# EAGLE design Power_Sense_Rev_2.2.1 (EAGLE 7.7.0)
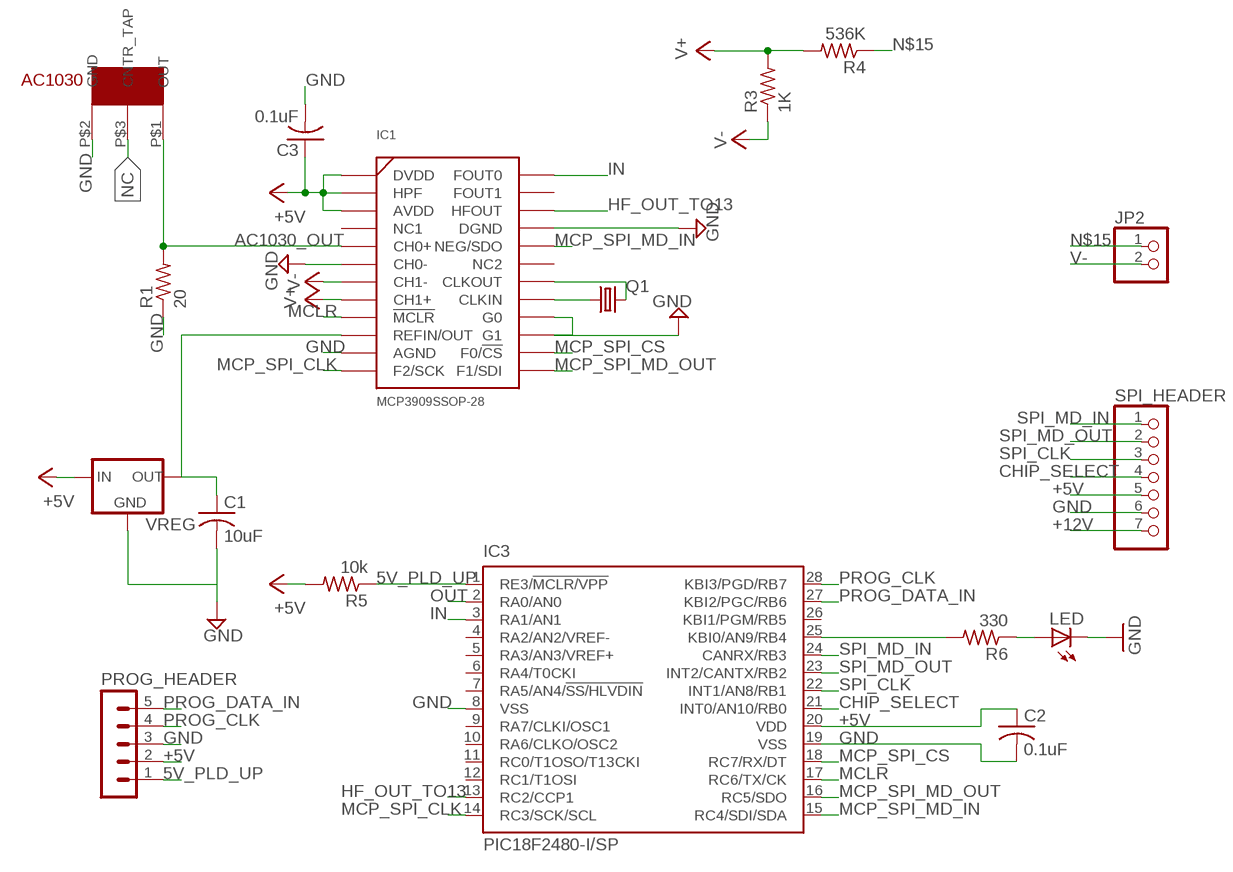
[diagram p0: schematic, sheet 1]

## Parts
AC1030  AC1030  [AC1030]
C1  10uF  C-US025-024X044  [C025-024X044]
C2  0.1uF  C-US025-024X044  [C025-024X044]
C3  0.1uF  C-US025-024X044  [C025-024X044]
IC1  MCP3909SSOP-28  [SSOP-24]
IC3  PIC18F2480-I/SP  [DIL28-3]
JP2  PINHD-1X2  [1X02]
LED  LED3MM  [LED3MM]
PROG_HEADER  MA05-1  [MA05-1]
Q1  CRYSTALHC49S  [HC49/S]
R1  20  R-US_0204/7  [0204/7]
R3  1K  R-US_0204/7  [0204/7]
R4  536K  R-US_0204/7  [0204/7]
R5  10k  R-US_0204/7  [0204/7]
R6  330  R-US_0204/7  [0204/7]
SPI_HEADER  PINHD-1X7  [1X07]
VREG  MCP1700INLINE  [TO92-INLINE]

## Nets
5V_PLD_UP: IC3.1(RE3/!MCLR/VPP) PROG_HEADER.1 R5.1
+5V: C2.1 C3.1 IC1.1(DVDD) IC1.2(HPF) IC1.3(AVDD) IC3.20(VDD) PROG_HEADER.2 R5.2 SPI_HEADER.5 VREG.2(IN)
+12V: SPI_HEADER.7
AC1030_OUT: AC1030.P$1(OUT) IC1.5(CH0+) R1.2
CHIP_SELECT: IC3.21(INT0/AN10/RB0) SPI_HEADER.4
GND: AC1030.P$2(GND) C1.2 C2.2 C3.2 IC1.6(CH0-) IC1.11(AGND) IC1.15(G1) IC1.16(G0) IC1.21(DGND) IC3.8(VSS) IC3.19(VSS) LED.K(C) PROG_HEADER.3 R1.1 SPI_HEADER.6 VREG.1(GND)
HF_OUT_TO13: IC1.22(HFOUT) IC3.13(RC2/CCP1)
IN: IC1.24(FOUT0) IC3.3(RA1/AN1)
MCLR: IC1.9(!MCLR!) IC3.17(RC6/TX/CK)
MCP_SPI_CLK: IC1.12(F2/SCK) IC3.14(RC3/SCK/SCL)
MCP_SPI_CS: IC1.14(F0/!CS!) IC3.18(RC7/RX/DT)
MCP_SPI_MD_IN: IC1.20(NEG/SDO) IC3.15(RC4/SDI/SDA)
MCP_SPI_MD_OUT: IC1.13(F1/SDI) IC3.16(RC5/SDO)
N$1: IC3.25(KBI0/AN9/RB4) R6.2
N$2: LED.A R6.1
N$5: IC1.17(CLKIN) Q1.1
N$6: IC1.18(CLKOUT) Q1.2
N$7: C1.1 IC1.10(REFIN/OUT) VREG.3(OUT)
N$15: JP2.1 R4.1
NC: AC1030.P$3(CNTR_TAP)
OUT: IC3.2(RA0/AN0)
PROG_CLK: IC3.28(KBI3/PGD/RB7) PROG_HEADER.4
PROG_DATA_IN: IC3.27(KBI2/PGC/RB6) PROG_HEADER.5
SPI_CLK: IC3.22(INT1/AN8/RB1) SPI_HEADER.3
SPI_MD_IN: IC3.24(CANRX/RB3) SPI_HEADER.1
SPI_MD_OUT: IC3.23(INT2/CANTX/RB2) SPI_HEADER.2
V+: IC1.8(CH1+) R3.2 R4.2
V-: IC1.7(CH1-) JP2.2 R3.1
Unconnected: IC1.4(NC1) IC1.19(NC2) IC1.23(FOUT1) IC3.4(RA2/AN2/VREF-) IC3.5(RA3/AN3/VREF+) IC3.6(RA4/T0CKI) IC3.7(RA5/AN4/!SS/HLVDIN) IC3.9(RA7/CLKI/OSC1) IC3.10(RA6/CLKO/OSC2) IC3.11(RC0/T1OSO/T13CKI) IC3.12(RC1/T1OSI) IC3.26(KBI1/PGM/RB5)

## Library data of the parts
AC1030 = .KWHR Library:AC1030
C1-C3 = adafruit:C-US: CAPACITOR, American symbol
IC1 = .KWHR Library:MCP3909: MCP3909 - We use this to sense current; HEIGHT: 1.65
IC3 = microchip:PIC18F2*80: 28-Pin Enhanced Flash Microcontrollers with ECAN(TM) Technology 10-Bit A/D and nanoWatt Technology Source: http://www.microchip.com .. 39637a.pdf; MF: MICROCHIP; MPN: PIC18F2480-I/SP; OC_FARNELL: 9321217; OC_NEWARK: 71J7237
JP2 = pinhead:PINHD-1X2: PIN HEADER
LED = led:LED: LED OSRAM: - CHIPLED LG R971, LG N971, LY N971, LG Q971, LY Q971, LO R971, LY R971 LH N974, LH R974 LS Q976, LO Q976, LY Q976 LO Q996 - Hyper CHIPLED LW Q18S LB Q993, LB Q99A, LB R99A - SideLED LS A670, LO A670, LY A670, LG A670, LP A670 LB A673, LV A673, LT A673, LW A673 LH A674 LY A675 LS A676, LA A676, LO A676, LY A676, LW A676 LS A679, LY A679, LG A679 - Hyper Micro SIDELED® LS Y876, LA Y876, LO Y876, LY Y876 LT Y87S - SmartLED LW L88C, LW L88S LB L89C, LB L89S, LG L890 LS L89K, LO L89K, LY L89K LS L896, LA L896, LO L896, LY L896 - TOPLED LS T670, LO T670, LY T670, LG T670, LP T670 LSG T670, LSP T670, LSY T670, LOP T670, LYG T670 LG T671, LOG T671, LSG T671 LB T673, LV T673, LT T673, LW T673 LH T674 LS T676, LA T676, LO T676, LY T676, LB T676, LH T676, LSB T676, LW T676 LB T67C, LV T67C, LT T67C, LS T67K, LO T67K, LY T67K, LW E67C LS E67B, LA E67B, LO E67B, LY E67B, LB E67C, LV E67C, LT E67C LW T67C LS T679, LY T679, LG T679 LS T770, LO T770, LY T770, LG T770, LP T770 LB T773, LV T773, LT T773, LW T773 LH T774 LS E675, LA E675, LY E675, LS T675 LS T776, LA T776, LO T776, LY T776, LB T776 LHGB T686 LT T68C, LB T68C - Hyper Mini TOPLED® LB M676 - Mini TOPLED Santana® LG M470 LS M47K, LO M47K, LY M47K Source: http://www.osram.convergy.de LUXEON: - LUMILED® LXK2-PW12-R00, LXK2-PW12-S00, LXK2-PW14-U00, LXK2-PW14-V00 LXK2-PM12-R00, LXK2-PM12-S00, LXK2-PM14-U00 LXK2-PE12-Q00, LXK2-PE12-R00, LXK2-PE12-S00, LXK2-PE14-T00, LXK2-PE14-U00 LXK2-PB12-K00, LXK2-PB12-L00, LXK2-PB12-M00, LXK2-PB14-N00, LXK2-PB14-P00, LXK2-PB14-Q00 LXK2-PR12-L00, LXK2-PR12-M00, LXK2-PR14-Q00, LXK2-PR14-R00 LXK2-PD12-Q00, LXK2-PD12-R00, LXK2-PD12-S00 LXK2-PH12-R00, LXK2-PH12-S00 LXK2-PL12-P00, LXK2-PL12-Q00, LXK2-PL12-R00 Source: www.luxeon.com KINGBRIGHT: KA-3528ASYC Source: www.kingbright.com
PROG_HEADER = con-lstb:MA05-1: PIN HEADER; OC_FARNELL: unknown; OC_NEWARK: unknown
Q1 = adafruit:CRYSTAL: CRYSTAL; OC_FARNELL: 1667008; OC_NEWARK: unknown
R1 R3-R6 = adafruit:R-US_: RESISTOR, American symbol
SPI_HEADER = pinhead:PINHD-1X7: PIN HEADER
VREG = adafruit:MCP1700: VOLTAGE REGULATOR

## Net classes
0 default: width 0.762 mm

## Board
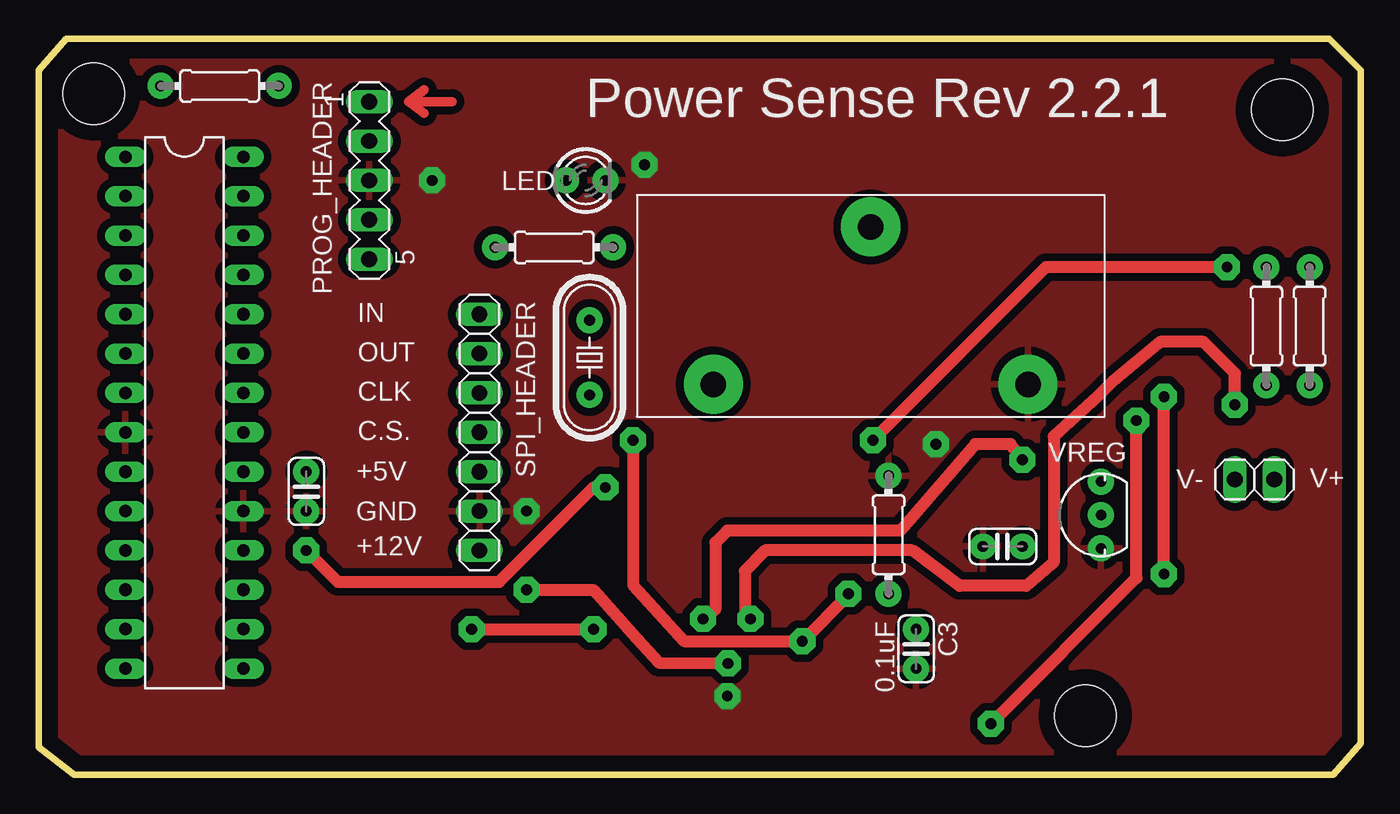
[diagram p1: board, top side]
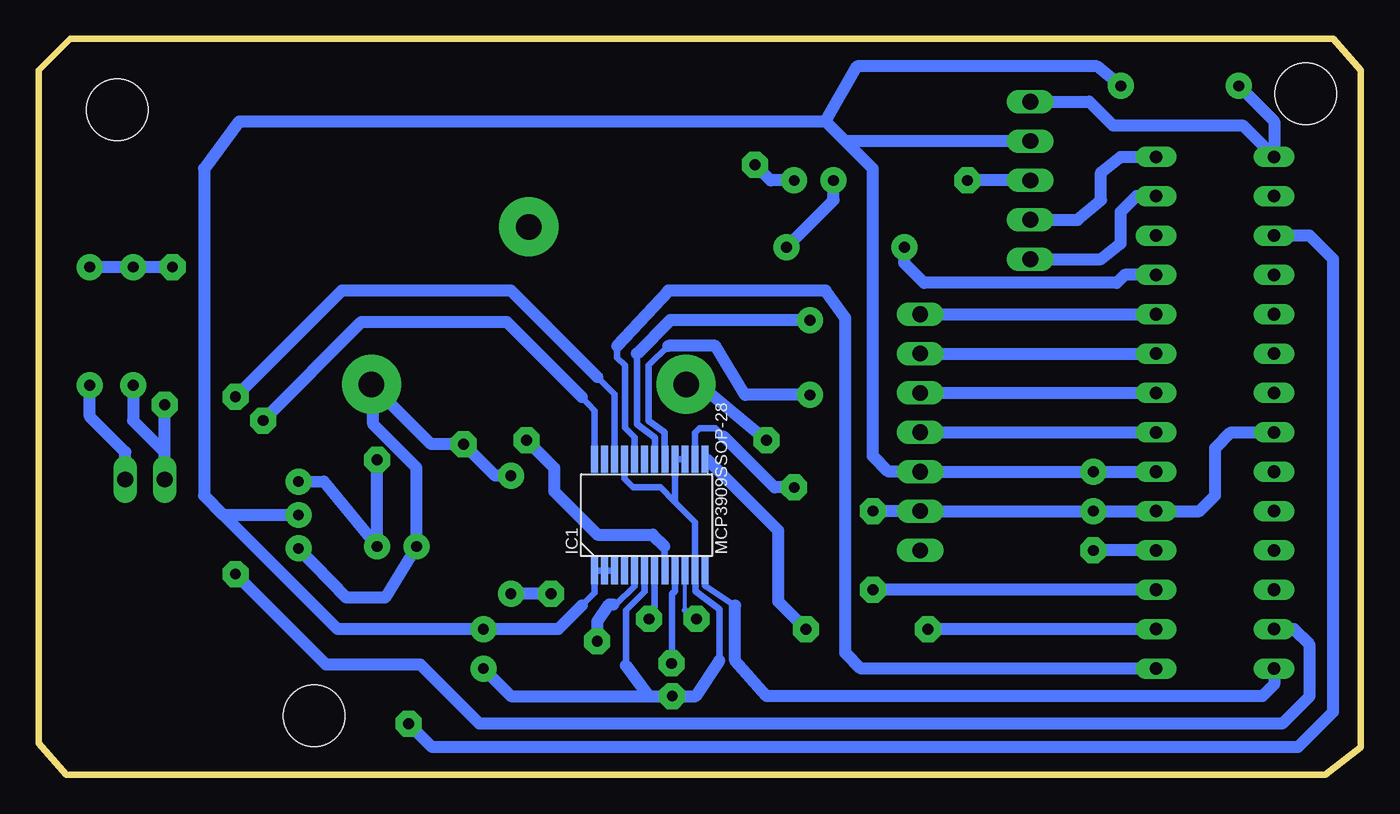
[diagram p2: board, bottom side, seen from below]

Size 85.34 x 47.5 mm. Coordinates in mm from the lower left corner, seen from the top.
Outline: 1.78,47.5 83.31,47.5 85.34,45.47 85.34,2.03 83.57,0 2.29,0 0,1.78 0,45.47 1.78,47.5
Copper layers (1*16): Top 0.035mm / dielectric 1.5mm / Bottom 0.035mm
Design rules "default *": minimum track width 25mil, minimum drill 20mil, track to track 20mil, track to pad 20mil, pad to pad 20mil, via to via 20mil, smd to smd 8mil, copper to edge 40mil, drill to drill 8mil, minimum pad ring 10mil, minimum via ring 8mil, stop-mask expansion 4mil, vias tented up to drill 0mil, thermal gap 20mil
Holes 3.97 mm at 80.26,42.93 3.56,43.94 67.56,3.81

### Footprints (pad centres in the part's own frame; a part is rotated, then mirrored left to right if it is on the bottom)
AC1030 = drill 1.651 pad 3.81: P$1 4.94,2.08; P$2 25.26,2.08; P$3 15.1,12.24
C025-024X044 = drill 0.7 pad 1.676: 1 -1.27,0; 2 1.27,0
SSOP-24 = smd 1.75 x 0.45: 1 -3.6,3.25; 2 -3.6,2.6; 3 -3.6,1.95; 4 -3.6,1.3; 5 -3.6,0.65; 6 -3.6,0; 7 -3.6,-0.65; 8 -3.6,-1.3; 9 -3.6,-1.95; 10 -3.6,-2.6; 11 -3.6,-3.25; 12 -3.6,-3.9; 13 3.6,-3.9; 14 3.6,-3.25; 15 3.6,-2.6; 16 3.6,-1.95; 17 3.6,-1.3; 18 3.6,-0.65; 19 3.6,0; 20 3.6,0.65; 21 3.6,1.3; 22 3.6,1.95; 23 3.6,2.6; 24 3.6,3.25
DIL28-3 = drill 0.813 long: 1 -16.51,-3.81; 2 -13.97,-3.81; 3 -11.43,-3.81; 4 -8.89,-3.81; 5 -6.35,-3.81; 6 -3.81,-3.81; 7 -1.27,-3.81; 8 1.27,-3.81; 9 3.81,-3.81; 10 6.35,-3.81; 11 8.89,-3.81; 12 11.43,-3.81; 13 13.97,-3.81; 14 16.51,-3.81; 15 16.51,3.81; 16 13.97,3.81; 17 11.43,3.81; 18 8.89,3.81; 19 6.35,3.81; 20 3.81,3.81; 21 1.27,3.81; 22 -1.27,3.81; 23 -3.81,3.81; 24 -6.35,3.81; 25 -8.89,3.81; 26 -11.43,3.81; 27 -13.97,3.81; 28 -16.51,3.81
1X02 = drill 1.016 long: 1 -1.27,0; 2 1.27,0
LED3MM = drill 0.7 pad 1.676: A -1.27,0; K 1.27,0
MA05-1 = drill 1.016 long: 1 -5.08,0; 2 -2.54,0; 3 0,0; 4 2.54,0; 5 5.08,0
HC49/S = drill 0.7 pad 1.676: 1 -2.413,0; 2 2.413,0
0204/7 = drill 0.7 pad 1.676: 1 -3.81,0; 2 3.81,0
1X07 = drill 1.016 long: 1 -7.62,0; 2 -5.08,0; 3 -2.54,0; 4 0,0; 5 2.54,0; 6 5.08,0; 7 7.62,0
TO92-INLINE = drill 0.7 pad 1.676: 1 -2.159,0; 2 0,0; 3 2.159,0

### Placement (x,y rotation side)
AC1030  38.61,23.11 0 top
C1  62.23,14.73 180 top
C2  17.27,18.29 270 top
C3  56.64,8.13 270 top
IC1  46.23,16.76 90 bottom
IC3  9.4,23.37 270 top
JP2  78.49,19.05 180 top
LED  35.31,38.35 0 top
PROG_HEADER  21.34,38.35 270 top
Q1  35.56,26.92 90 top
R1  54.86,15.49 270 top
R3  79.25,28.96 90 top
R4  82.04,28.96 90 top
R5  11.68,44.45 0 top
R6  33.27,34.04 180 top
SPI_HEADER  28.45,22.1 270 top
VREG  68.58,16.76 90 top

### Tracks (layer width: path | path; a pad name or v marks a point on that pad's centre or on a via)
5V_PLD_UP
  Bottom 0.762: R5.1 5.59,42.16 IC3.1 7.62,41.91 16,41.91 17.53,43.43 PROG_HEADER.1
+5V
  Bottom 0.406: IC1.3 IC1.2 IC1.1 49.48,11.74 50.29,10.92
  Bottom 0.762: 34.54,42.16 72.39,42.16 74.68,39.12 74.68,18.03 73.41,16.76 | 34.54,42.16 32.51,45.72 17.02,45.72 R5.2 | IC3.20 C2.1 SPI_HEADER.5 30.48,19.56 31.5,20.57 31.5,39.12 33.27,40.89 | VREG.2 73.41,16.76 | 73.41,16.76 66.04,9.4 C3.1 51.82,9.4 50.29,10.92 | 33.27,40.89 34.54,42.16 | PROG_HEADER.2 33.27,40.89
AC1030_OUT  (via drill 0.7 pad 1.68)
  Top 0.762: v38.35,21.59 38.37,12.25 41.67,8.62 v49.29,8.62 52.28,11.61 v52.27,11.68
  Bottom 0.406: 48.26,10.99 48.06,10.99 46.89,12.16 IC1.5
  Bottom 0.762: v49.29,8.62 49.28,9.91 48.51,10.99 48.26,10.99 | AC1030.P$1 42.72,25.19 v38.35,21.59 | v52.27,11.68 52.28,11.69 R1.2
CHIP_SELECT
  Bottom 0.762: SPI_HEADER.4 IC3.21
GND  (via drill 0.7 pad 1.68)
  Bottom 0.406: IC1.15 IC1.16 44.28,17.7 44.32,17.65 | 41.4,7.37 41.4,10.67 42.96,11.84 IC1.11 42.98,16.31 44.32,17.65 | IC1.6 46.23,11.82 47.44,10.61 47.44,7.05 | 44.32,17.65 45.21,18.54 46.97,18.54 47.53,19.09 IC1.21
  Bottom 0.762: VREG.1 65.47,11.43 62.99,11.43 C1.2 60.96,19.81 63.75,22.61 63.75,25.08 | 41.4,7.37 42.93,5.08 v44.45,5.08 45.97,5.08 | 47.44,7.05 45.97,5.08 | IC3.8 8.38,22.1 9.4,21.08 9.4,18.03 10.41,17.02 IC3.19 C2.2 SPI_HEADER.6 v31.5,17.02 | R1.1 55.88,19.3 v57.91,21.34 60.01,21.34 63.75,25.08 | PROG_HEADER.3 v25.4,38.35 | 63.75,25.08 AC1030.P$2 | LED.K 38.1,38.35 v39.12,39.37 | C3.2 54.86,5.08 45.97,5.08
  pour Top: 1.02,44.96 2.29,46.48 83.06,46.48 84.33,45.21 84.33,2.54 83.06,1.02 2.79,1.02 1.27,2.54
HF_OUT_TO13  (via drill 0.7 pad 1.68)
  Top 0.762: v72.64,12.95 v72.64,24.38
  Bottom 0.406: IC1.22 48.18,24.56 49.28,25.65
  Bottom 0.762: 49.28,25.65 54.86,31.24 65.79,31.24 v72.64,24.38 | v72.64,12.95 66.8,7.11 60.71,7.11 56.9,3.3 5.08,3.3 3.3,5.08 3.3,8.38 4.32,9.4 IC3.13
IN  (via drill 0.7 pad 1.68)
  Top 0.762: v61.47,3.3 70.87,12.7 v70.87,22.86
  Bottom 0.406: 50.29,24.38 49.46,23.5 49.46,20.38 IC1.24
  Bottom 0.762: 50.29,24.38 55.12,29.21 64.52,29.21 v70.87,22.86 | v61.47,3.3 59.94,1.78 4.06,1.78 1.78,4.06 1.78,33.27 3.3,34.8 IC3.3
MCLR  (via drill 0.7 pad 1.68)
  Top 0.762: v31.5,11.94 35.81,11.94 38.57,8.81 40.04,7.24 v44.5,7.18
  Bottom 0.406: IC1.9 44.28,11.86 44.45,11.68 44.45,7.23 v44.5,7.18
  Bottom 0.762: IC3.17 v31.5,11.94
MCP_SPI_CLK
  Bottom 0.406: 40.39,10.92 42.33,12.19 IC1.12
  Bottom 0.762: IC3.14 5.59,5.84 6.35,5.08 38.35,5.08 40.39,7.37 40.39,10.92
MCP_SPI_CS  (via drill 0.7 pad 1.68)
  Top 0.762: v17.27,14.48 19.3,12.45 29.72,12.45 35.81,18.54 v36.58,18.54
  Bottom 0.406: 41.15,21.84 41.66,22.35 42.69,22.35 42.97,22.07 IC1.14
  Bottom 0.762: IC3.18 v17.27,14.48 | v36.58,18.54 37.85,18.54 41.15,21.84
MCP_SPI_MD_IN
  Bottom 0.406: 48.01,27.69 48.01,26.92 47.5,26.42 47.5,22.4 46.87,21.77 IC1.20
  Bottom 0.762: IC3.15 32.26,6.86 33.27,7.87 33.27,29.46 34.54,31.24 44.7,31.24 48.01,27.69
MCP_SPI_MD_OUT  (via drill 0.7 pad 1.68)
  Top 0.762: v27.94,9.4 v35.81,9.4
  Bottom 0.406: IC1.13 42.21,20.36 42.16,20.32
  Bottom 0.762: IC3.16 v27.94,9.4 | v35.81,9.4 37.59,11.18 37.59,15.75 42.16,20.32
N$1
  Bottom 0.762: IC3.25 15.24,32.26 15.75,31.75 28.19,31.75 29.46,33.02 R6.2
N$2
  Bottom 0.762: R6.1 34.04,37.08 LED.A
N$5
  Bottom 0.406: 44.7,27.69 45.97,26.42 45.97,22.86 44.93,22.1 IC1.17
  Bottom 0.762: Q1.1 39.75,24.51 41.66,27.69 44.7,27.69
N$6
  Bottom 0.406: 46.74,27.18 46.74,22.61 45.57,21.74 IC1.18
  Bottom 0.762: Q1.2 44.58,29.34 46.74,27.18
N$7  (via drill 0.7 pad 1.68)
  Top 0.762: v63.5,20.32 62.74,21.34 60.45,21.34 55.63,15.75 44.45,15.75 43.69,14.99 43.69,10.67 v42.88,10.06
  Bottom 0.254: 43.63,10.61 IC1.10
  Bottom 0.406: v42.88,10.06 43.63,10.61
  Bottom 0.762: VREG.3 66.95,18.94 C1.1 v63.5,20.32
N$15
  Bottom 0.762: R4.1 82.04,23.11 79.76,20.83 JP2.1
N$33
  Top 0.61: 24.89,44.2 23.88,43.43 26.67,43.43
N$34
  Top 0.61: 23.87,43.44 24.89,42.68
PROG_CLK
  Bottom 0.762: IC3.28 15.49,39.88 16.76,38.86 16.76,37.08 18.29,35.81 PROG_HEADER.4
PROG_DATA_IN
  Bottom 0.762: IC3.27 14.48,37.34 15.49,36.32 15.49,34.29 16.76,33.27 PROG_HEADER.5
SPI_CLK
  Bottom 0.762: SPI_HEADER.3 IC3.22
SPI_MD_IN
  Bottom 0.762: SPI_HEADER.1 IC3.24
SPI_MD_OUT
  Bottom 0.762: SPI_HEADER.2 IC3.23
V+  (via drill 0.7 pad 1.68)
  Top 0.762: v76.71,32.77 65.02,32.77 v53.85,21.59
  Bottom 0.406: 44.96,14.73 44.96,13.19 IC1.8
  Bottom 0.762: v53.85,21.59 52.07,19.81 52.07,18.29 49.28,15.49 45.72,15.49 44.96,14.73 | v76.71,32.77 R3.2 R4.2
V-  (via drill 0.7 pad 1.68)
  Top 0.762: v45.94,10.06 45.58,10.3 IC1.7 46.89,14.48 56.39,14.48 59.44,12.19 63.75,12.19 65.53,13.72 65.53,21.84 68.33,24.38 69.34,25.4 72.39,27.94 75.18,27.94 77.22,25.91 v77.22,23.88
  Bottom 0.406: v45.94,10.06 45.6,10.49 45.6,11.11 45.6,13.14 IC1.7
  Bottom 0.762: R3.1 79.25,22.86 77.22,20.83 | 77.22,20.83 v77.22,23.88 | JP2.2 77.22,20.83

### Text on the board
tNames: Power Sense Rev 2.2.1 | IN | OUT | CLK | C.S. | +5V | V- | V+ | GND | +12V
Notes: Design Constraints: / Traces: Width - 30 / Vias: Octagon, Drill - 27.55906, Diameter - 66 | Changes Made: / 1. Remove the Pulse Out line and connector / 2. Remove diodes and pull up resistor that connected LFout pins to the IN pin of the PIC / 3. Connect MCP pin 24 (LFout0) to PIC IN / 4. Add HFout trace from MCP to PIC pin 13